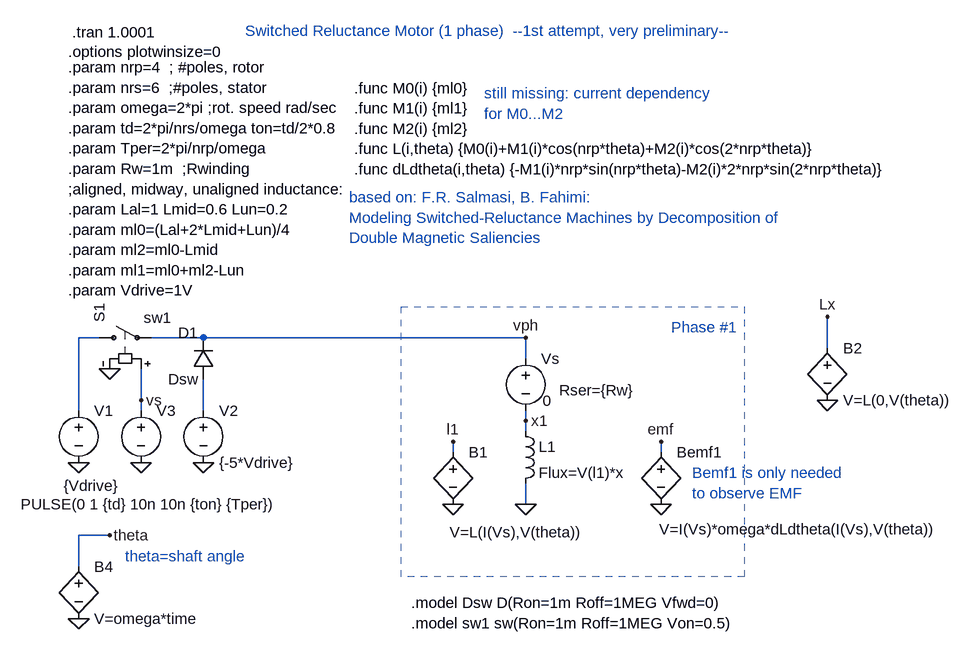
[diagram p0: schematic srm.asc]
srm.asc, the LTspice schematic file:
Version 4
SHEET 1 1736 680
WIRE 112 80 112 -32
WIRE 112 320 112 272
WIRE 144 -32 112 -32
WIRE 160 272 112 272
WIRE 208 64 208 16
WIRE 208 80 208 64
WIRE 304 -32 224 -32
WIRE 304 80 304 32
WIRE 688 144 688 128
WIRE 800 -32 304 -32
WIRE 800 0 800 -32
WIRE 800 96 800 80
WIRE 800 112 800 96
WIRE 800 224 800 192
WIRE 1008 144 1008 128
WIRE 1264 -16 1264 -64
FLAG 1008 224 0
FLAG 112 160 0
FLAG 112 400 0
FLAG 160 272 theta
FLAG 1008 128 emf
FLAG 800 96 x1
FLAG 800 -32 vph
FLAG 208 160 0
FLAG 160 16 0
FLAG 304 160 0
FLAG 688 224 0
FLAG 688 128 l1
FLAG 800 224 0
FLAG 1264 64 0
FLAG 1264 -64 Lx
FLAG 208 64 vs
SYMBOL bv 1008 128 R0
WINDOW 3 -3 135 Left 0
SYMATTR Value V=I(Vs)*omega*dLdtheta(I(Vs),V(theta))
SYMATTR InstName Bemf1
SYMBOL voltage 800 -16 R0
WINDOW 3 26 81 Left 0
WINDOW 123 0 0 Left 0
WINDOW 39 51 65 Left 0
SYMATTR Value 0
SYMATTR SpiceLine Rser={Rw}
SYMATTR InstName Vs
SYMBOL bv 112 304 R0
SYMATTR InstName B4
SYMATTR Value V=omega*time
SYMBOL diode 320 32 R180
WINDOW 0 24 72 Left 0
WINDOW 3 24 0 Left 0
SYMATTR InstName D1
SYMATTR Value Dsw
SYMBOL sw 128 -32 R270
WINDOW 3 31 84 VRight 0
SYMATTR Value sw1
SYMATTR InstName S1
SYMBOL voltage 112 64 R0
WINDOW 123 0 0 Left 0
WINDOW 39 0 0 Left 0
WINDOW 3 -23 132 Left 0
SYMATTR Value {Vdrive}
SYMATTR InstName V1
SYMBOL voltage 304 64 R0
WINDOW 123 0 0 Left 0
WINDOW 39 0 0 Left 0
SYMATTR InstName V2
SYMATTR Value {-5*Vdrive}
SYMBOL ind 784 96 R0
SYMATTR InstName L1
SYMATTR Value Flux=V(l1)*x
SYMBOL bv 688 128 R0
WINDOW 3 -5 139 Left 0
SYMATTR Value V=L(I(Vs),V(theta))
SYMATTR InstName B1
SYMBOL bv 1264 -32 R0
SYMATTR InstName B2
SYMATTR Value V=L(0,V(theta))
SYMBOL voltage 208 64 R0
WINDOW 3 -185 160 Left 0
WINDOW 123 0 0 Left 0
WINDOW 39 0 0 Left 0
SYMATTR Value PULSE(0 1 {td} 10n 10n {ton} {Tper})
SYMATTR InstName V3
TEXT 102 -502 Left 0 !.tran 1.0001
TEXT 96 -448 Left 0 !.param nrp=4  ; #poles, rotor\n.param nrs=6  ;#poles, stator\n.param omega=2*pi ;rot. speed rad/sec\n.param td=2*pi/nrs/omega ton=td/2*0.8\n.param Tper=2*pi/nrp/omega\n.param Rw=1m  ;Rwinding\n;aligned, midway, unaligned inductance:\n.param Lal=1 Lmid=0.6 Lun=0.2\n.param ml0=(Lal+2*Lmid+Lun)/4\n.param ml2=ml0-Lmid\n.param ml1=ml0+ml2-Lun\n.param Vdrive=1V
TEXT 96 -472 Left 0 !.options plotwinsize=0
TEXT 536 -416 Left 0 !.func M0(i) {ml0}\n.func M1(i) {ml1}\n.func M2(i) {ml2}\n.func L(i,theta) {M0(i)+M1(i)*cos(nrp*theta)+M2(i)*cos(2*nrp*theta)}\n.func dLdtheta(i,theta) {-M1(i)*nrp*sin(nrp*theta)-M2(i)*2*nrp*sin(2*nrp*theta)}
TEXT 624 376 Left 0 !.model Dsw D(Ron=1m Roff=1MEG Vfwd=0)\n.model sw1 sw(Ron=1m Roff=1MEG Von=0.5)
TEXT 1024 -48 Left 0 ;Phase #1
TEXT 184 304 Left 0 ;theta=shaft angle
TEXT 368 -504 Left 0 ;Switched Reluctance Motor (1 phase)  --1st attempt, very preliminary--
TEXT 736 -408 Left 0 ;still missing: current dependency\nfor M0...M2
TEXT 528 -248 Left 0 ;based on: F.R. Salmasi, B. Fahimi:\nModeling Switched-Reluctance Machines by Decomposition of\nDouble Magnetic Saliencies
TEXT 1056 176 Left 0 ;Bemf1 is only needed\nto observe EMF
RECTANGLE Normal 1136 336 608 -80 2

The netlist it stands for:
* srm.asc
Bemf1 emf 0 V=I(Vs)*omega*dLdtheta(I(Vs),V(theta))
Vs vph x1 0 Rser={Rw}
B4 theta 0 V=omega*time
D1 N002 vph Dsw
S1 N001 vph vs 0 sw1
V1 N001 0 {Vdrive}
V2 N002 0 {-5*Vdrive}
L1 x1 0 Flux=V(l1)*x
B1 l1 0 V=L(I(Vs),V(theta))
B2 Lx 0 V=L(0,V(theta))
V3 vs 0 PULSE(0 1 {td} 10n 10n {ton} {Tper})
.model D D
.lib standard.dio
.tran 1.0001
.param nrp=4  ; #poles, rotor
.param nrs=6  ;#poles, stator
.param omega=2*pi ;rot. speed rad/sec
.param td=2*pi/nrs/omega ton=td/2*0.8
.param Tper=2*pi/nrp/omega
.param Rw=1m  ;Rwinding
;aligned, midway, unaligned inductance:
.param Lal=1 Lmid=0.6 Lun=0.2
.param ml0=(Lal+2*Lmid+Lun)/4
.param ml2=ml0-Lmid
.param ml1=ml0+ml2-Lun
.param Vdrive=1V
.options plotwinsize=0
.func M0(i) {ml0}
.func M1(i) {ml1}
.func M2(i) {ml2}
.func L(i,theta) {M0(i)+M1(i)*cos(nrp*theta)+M2(i)*cos(2*nrp*theta)}
.func dLdtheta(i,theta) {-M1(i)*nrp*sin(nrp*theta)-M2(i)*2*nrp*sin(2*nrp*theta)}
.model Dsw D(Ron=1m Roff=1MEG Vfwd=0)
.model sw1 sw(Ron=1m Roff=1MEG Von=0.5)
* Phase #1
* theta=shaft angle
* Switched Reluctance Motor (1 phase)  --1st attempt, very preliminary--
* still missing: current dependency
* for M0...M2
* based on: F.R. Salmasi, B. Fahimi:
* Modeling Switched-Reluctance Machines by Decomposition of
* Double Magnetic Saliencies
* Bemf1 is only needed
* to observe EMF
.backanno
.end